# Altium schematic sheet Connectors.SchDoc
size A; SheetNumber: 2; SheetTotal: 3
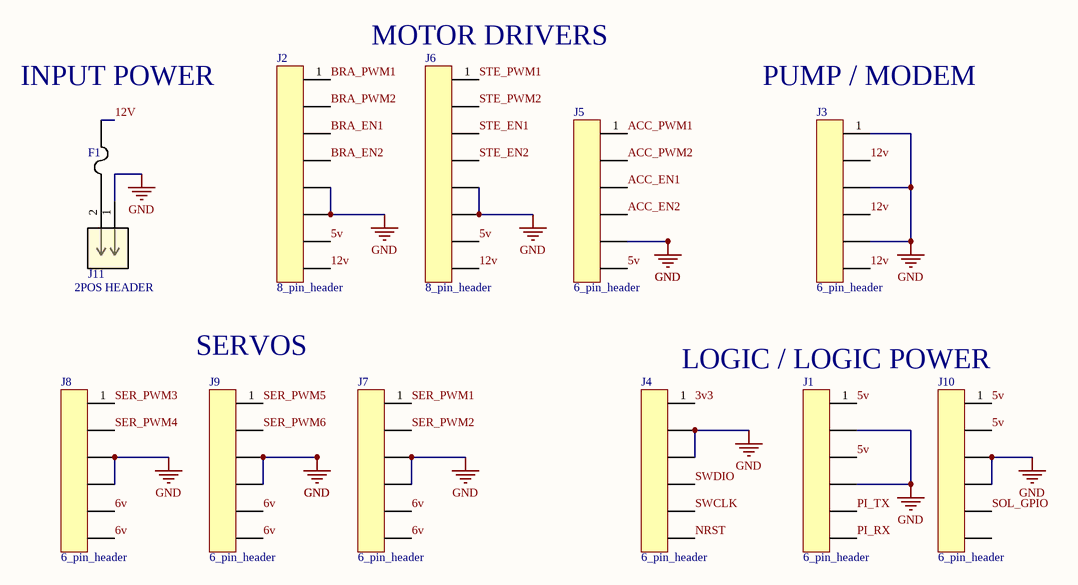
[diagram p0: Connectors.SchDoc]

## Parts
F1  FUSE_178.6764.0001_LTF  [fuse_holder]  (value not drawn)
J1  6_pin_header  [6pinHeader1]
J2  8_pin_header  [8pinHeader]
J3  6_pin_header  [6pinHeader2]
J4  6_pin_header  [6pinHeader1]
J5  6_pin_header  [6pinHeader1]
J6  8_pin_header  [8pinHeader]
J7  6_pin_header  [6pinHeader1]
J8  6_pin_header  [6pinHeader1]
J9  6_pin_header  [6pinHeader1]
J10  6_pin_header  [6pinHeader1]
J11  2POS HEADER  [CONN HEADER VERT 2POS]

## Nets
GND: J1.2 J1.4 J2.5 J2.6 J3.1 J3.3 J3.5 J4.2 J4.3 J5.5 J6.5 J6.6 J7.3 J7.4 J8.3 J8.4 J9.3 J9.4 J10.3 J10.4 J11.1
3v3: J4.1
5v: J1.1 J1.3 J2.7 J5.6 J6.7 J10.1 J10.2
6v: J7.5 J7.6 J8.5 J8.6 J9.5 J9.6
12V: F1.2 J2.8 J3.2 J3.4 J3.6 J6.8
ACC_EN1: J5.3
ACC_EN2: J5.4
ACC_PWM1: J5.1
ACC_PWM2: J5.2
BRA_EN1: J2.3
BRA_EN2: J2.4
BRA_PWM1: J2.1
BRA_PWM2: J2.2
NRST: J4.6
PI_RX: J1.6
PI_TX: J1.5
SER_PWM1: J7.1
SER_PWM2: J7.2
SER_PWM3: J8.1
SER_PWM4: J8.2
SER_PWM5: J9.1
SER_PWM6: J9.2
SOL_GPIO: J10.5
STE_EN1: J6.3
STE_EN2: J6.4
STE_PWM1: J6.1
STE_PWM2: J6.2
SWCLK: J4.5
SWDIO: J4.4
NetF1_1: F1.1 J11.2

Not connected (* = marked no-connect by the designer): J10 6

## Notes on the sheet
- INPUT POWER
- (near J6) MOTOR DRIVERS
- (near J3) PUMP / MODEM
- (near J9) SERVOS
- LOGIC / LOGIC POWER

## Library data of the parts
J1 = 6_pin_header: Pi
J2 = 8_pin_header: Brake Motor
J3 = 6_pin_header: Solenoid/Pump/Modem
J4 = 6_pin_header: Onboard Stm
J5 = 6_pin_header: Accel Motor
J6 = 8_pin_header: Steering Motor
J7 = 6_pin_header: Servo1&2
J8 = 6_pin_header: Servo3&4
J9 = 6_pin_header: Servo5&6
J10 = 6_pin_header: OffboardSTM & SolenoidGPIO
J11 = CONN HEADER VERT 2POS: 12V INPUT